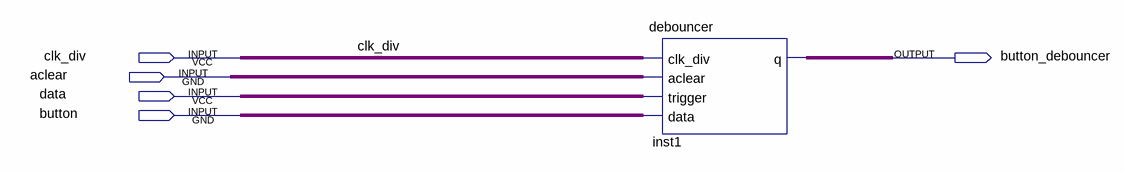
[diagram p0: schematic sheet]
// Quartus schematic h7_teste.bdf as structural Verilog: 1 symbols, 5 pins
module h7_teste (
  input  clk_div,
  input  aclear,
  input  data,
  input  button,
  output button_debouncer
);

  debouncer inst1 (.clk_div(clk_div), .aclear(aclear), .trigger(data), .data(button), .q(button_debouncer));
endmodule
